# Altium schematic sheet Display-Interface.SchDoc
size A3
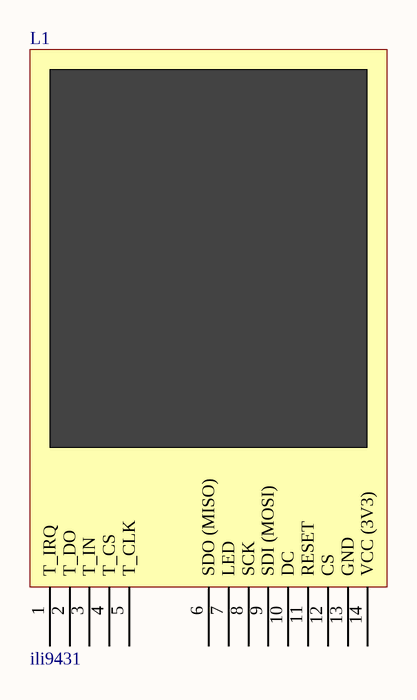
[diagram p0: Display-Interface.SchDoc]

## Parts
L1  ili9431  [ILI9431]

## Nets

Not connected (* = marked no-connect by the designer): L1 1(T_IRQ) 2(T_DO) 3(T_IN) 4(T_CS) 5(T_CLK) 6(SDO_(MISO)) 7(LED) 8(SCK) 9(SDI_(MOSI)) 10(DC) 11(RESET) 12(CS) 13(GND) 14(VCC_(3V3))